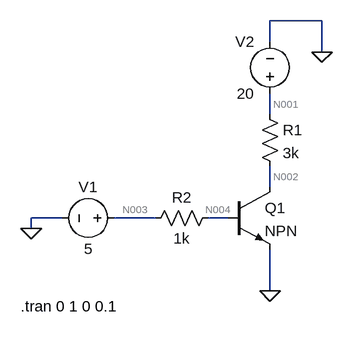
[diagram p0: schematic EJ2.asc]
EJ2.asc, the LTspice schematic file:
Version 4
SHEET 1 880 680
WIRE 464 -144 384 -144
WIRE 384 -112 384 -144
WIRE 464 -96 464 -144
WIRE 384 0 384 -32
WIRE 384 112 384 80
WIRE 64 160 16 160
WIRE 208 160 144 160
WIRE 320 160 288 160
WIRE 16 176 16 160
WIRE 384 272 384 208
FLAG 384 272 0
FLAG 16 176 0
FLAG 464 -96 0
SYMBOL npn 320 112 R0
SYMATTR InstName Q1
SYMBOL res 368 -16 R0
SYMATTR InstName R1
SYMATTR Value 3k
SYMBOL res 192 176 R270
WINDOW 0 32 56 VTop 2
WINDOW 3 0 56 VBottom 2
SYMATTR InstName R2
SYMATTR Value 1k
SYMBOL voltage 160 160 R90
WINDOW 0 -32 56 VBottom 2
WINDOW 3 32 56 VTop 2
WINDOW 123 0 0 Left 0
WINDOW 39 0 0 Left 0
SYMATTR InstName V1
SYMATTR Value 5
SYMBOL voltage 384 -16 R180
WINDOW 0 24 96 Left 2
WINDOW 3 24 16 Left 2
WINDOW 123 0 0 Left 0
WINDOW 39 0 0 Left 0
SYMATTR InstName V2
SYMATTR Value 20
TEXT 0 296 Left 2 !.tran 0 1 0 0.1

The netlist it stands for:
* EJ2.asc
Q1 N002 N004 0 0 NPN
R1 N001 N002 3k
R2 N003 N004 1k
V1 N003 0 5
V2 N001 0 20
.model NPN NPN
.model PNP PNP
.lib standard.bjt
.tran 0 1 0 0.1
.backanno
.end

* Results of the author's LTspice run, read from the files saved beside the schematic
* Operating Point, zero values left out:
*   V(n002) = 33.56 mV
*   V(n004) = 843.7 mV
*   V(n001) = 20 V
*   V(n003) = 5 V
*   Ic(Q1) = 6.655 mA
*   Ib(Q1) = 4.156 mA
*   Ie(Q1) = -10.81 mA
*   I(R1) = 6.655 mA
*   I(R2) = 4.156 mA
*   I(V1) = -4.156 mA
*   I(V2) = -6.655 mA
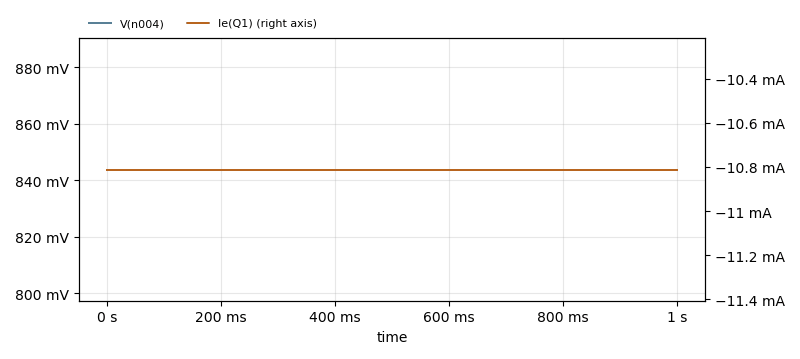
[diagram p1: Transient Analysis of EJ2.asc, plotted from the saved traces]
* Transient Analysis, 1 run:
*   V(n004): min 843.7 mV, max 843.7 mV, average 843.7 mV, rms 843.7 mV, last 843.7 mV
*   Ie(Q1): min -10.81 mA, max -10.81 mA, average -10.81 mA, rms 10.81 mA, last -10.81 mA